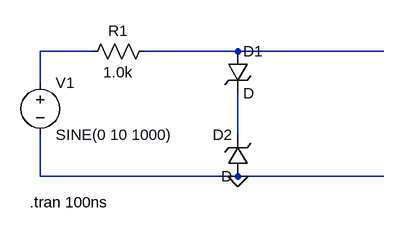
[diagram p0: schematic question3.asc]
question3.asc, the LTspice schematic file:
Version 4
SHEET 1 880 680
WIRE -32 96 -112 96
WIRE 192 96 48 96
WIRE 416 96 192 96
WIRE -112 144 -112 96
WIRE 192 224 192 160
WIRE -112 288 -112 224
WIRE 192 288 -112 288
WIRE 416 288 192 288
FLAG 192 288 0
SYMBOL zener 176 96 R0
SYMATTR InstName D1
SYMBOL zener 208 288 R180
WINDOW 0 24 64 Left 2
WINDOW 3 24 0 Left 2
SYMATTR InstName D2
SYMBOL res 64 80 R90
WINDOW 0 0 56 VBottom 2
WINDOW 3 32 56 VTop 2
SYMATTR InstName R1
SYMATTR Value 1.0k
SYMBOL voltage -112 128 R0
WINDOW 123 0 0 Left 2
WINDOW 39 0 0 Left 2
SYMATTR InstName V1
SYMATTR Value SINE(0 10 1000)
TEXT -128 328 Left 2 !.tran 100ns

The netlist it stands for:
* question3.asc
D1 N002 N003 D
D2 0 N003 D
R1 N002 N001 1.0k
V1 N001 0 SINE(0 10 1000)
.model D D
.lib standard.dio
.tran 100ns
.backanno
.end